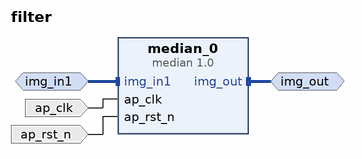
[diagram p0: block diagram of the top level]
# Vivado block design filter, xc7z020clg400-1, Vivado 2021.1
create_bd_design filter

create_bd_intf_port -mode Slave -vlnv xilinx.com:interface:axis_rtl:1.0 img_in1
set_property -dict [list \
  CONFIG.HAS_TKEEP 1 \
  CONFIG.HAS_TLAST 1 \
  CONFIG.HAS_TREADY 1 \
  CONFIG.HAS_TSTRB 1 \
  CONFIG.TDATA_NUM_BYTES 4 \
  CONFIG.TDEST_WIDTH 0 \
  CONFIG.TID_WIDTH 0 \
  CONFIG.TUSER_WIDTH 0 \
] [get_bd_intf_ports img_in1]
create_bd_intf_port -mode Master -vlnv xilinx.com:interface:axis_rtl:1.0 img_out
create_bd_port -dir I -type clk ap_clk
set_property -dict {CONFIG.ASSOCIATED_BUSIF img_out:img_in1 CONFIG.ASSOCIATED_RESET ap_rst_n} [get_bd_ports ap_clk]
create_bd_port -dir I -type rst ap_rst_n

create_bd_cell -type ip -vlnv hls:accel:median:1.0 median_0

# ---- connections ----

connect_bd_intf_net [get_bd_intf_ports img_out] [get_bd_intf_pins median_0/img_out]
connect_bd_intf_net [get_bd_intf_ports img_in1] [get_bd_intf_pins median_0/img_in1]
connect_bd_net [get_bd_ports ap_clk] [get_bd_pins median_0/ap_clk]
connect_bd_net [get_bd_ports ap_rst_n] [get_bd_pins median_0/ap_rst_n]

validate_bd_design
save_bd_design
